# EAGLE design IR Sensor (EAGLE 9.6.2)
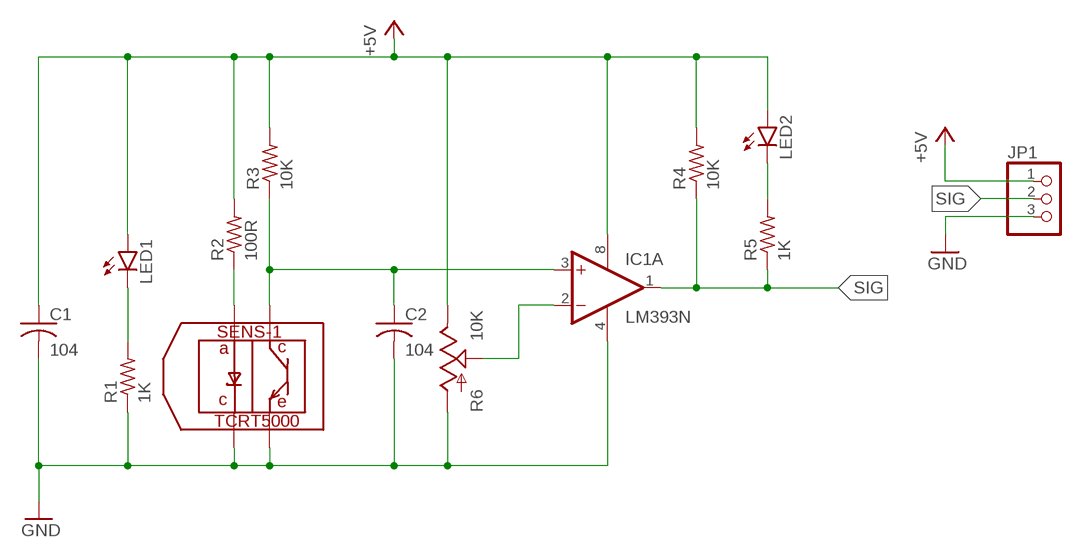
[diagram p0: schematic, sheet 1]

## Parts
C1  104  C-US050-045X075  [C050-045X075]
C2  104  C-US050-045X075  [C050-045X075]
IC1  LM393N  [DIL08]
JP1  PINHD-1X3  [1X03]
LED1  LED3MM  [LED3MM]
LED2  LED3MM  [LED3MM]
R1  1K  R-US_0207/7  [0207/7]
R2  100R  R-US_0207/7  [0207/7]
R3  10K  R-US_0207/7  [0207/7]
R4  10K  R-US_0207/7  [0207/7]
R5  1K  R-US_0207/7  [0207/7]
R6  10K  TRIM_US-CA6V  [CA6V]
SENS-1  TCRT5000  [5000]

## Nets
+5V: C1.1 IC1.8(P:V+) JP1.1 LED1.A LED2.A R2.2 R3.2 R4.2 R6.E
GND: C1.2 C2.2 IC1.4(P:V-) JP1.3 R1.1 R6.A SENS-1.P$2 SENS-1.P$4
N$1: LED1.K(C) R1.2
N$2: IC1.2(A:-IN) R6.S
N$3: R2.1 SENS-1.P$3
N$5: C2.1 IC1.3(A:+IN) R3.1 SENS-1.P$1
N$6: LED2.K(C) R5.2
SIG: IC1.1(A:OUT) JP1.2 R4.1 R5.1
Unconnected: IC1.5(B:+IN) IC1.6(B:-IN) IC1.7(B:OUT)

## Library data of the parts
C1 C2 = resistor:C-US: CAPACITOR, American symbol
IC1 = linear:LM393: COMPARATOR
JP1 = pinhead:PINHD-1X3: PIN HEADER
LED1 LED2 = led:LED: LED OSRAM: - CHIPLED LG R971, LG N971, LY N971, LG Q971, LY Q971, LO R971, LY R971 LH N974, LH R974 LS Q976, LO Q976, LY Q976 LO Q996 - Hyper CHIPLED LW Q18S LB Q993, LB Q99A, LB R99A - SideLED LS A670, LO A670, LY A670, LG A670, LP A670 LB A673, LV A673, LT A673, LW A673 LH A674 LY A675 LS A676, LA A676, LO A676, LY A676, LW A676 LS A679, LY A679, LG A679 - Hyper Micro SIDELED® LS Y876, LA Y876, LO Y876, LY Y876 LT Y87S - SmartLED LW L88C, LW L88S LB L89C, LB L89S, LG L890 LS L89K, LO L89K, LY L89K LS L896, LA L896, LO L896, LY L896 - TOPLED LS T670, LO T670, LY T670, LG T670, LP T670 LSG T670, LSP T670, LSY T670, LOP T670, LYG T670 LG T671, LOG T671, LSG T671 LB T673, LV T673, LT T673, LW T673 LH T674 LS T676, LA T676, LO T676, LY T676, LB T676, LH T676, LSB T676, LW T676 LB T67C, LV T67C, LT T67C, LS T67K, LO T67K, LY T67K, LW E67C LS E67B, LA E67B, LO E67B, LY E67B, LB E67C, LV E67C, LT E67C LW T67C LS T679, LY T679, LG T679 LS T770, LO T770, LY T770, LG T770, LP T770 LB T773, LV T773, LT T773, LW T773 LH T774 LS E675, LA E675, LY E675, LS T675 LS T776, LA T776, LO T776, LY T776, LB T776 LHGB T686 LT T68C, LB T68C - Hyper Mini TOPLED® LB M676 - Mini TOPLED Santana® LG M470 LS M47K, LO M47K, LY M47K Source: http://www.osram.convergy.de LUXEON: - LUMILED® LXK2-PW12-R00, LXK2-PW12-S00, LXK2-PW14-U00, LXK2-PW14-V00 LXK2-PM12-R00, LXK2-PM12-S00, LXK2-PM14-U00 LXK2-PE12-Q00, LXK2-PE12-R00, LXK2-PE12-S00, LXK2-PE14-T00, LXK2-PE14-U00 LXK2-PB12-K00, LXK2-PB12-L00, LXK2-PB12-M00, LXK2-PB14-N00, LXK2-PB14-P00, LXK2-PB14-Q00 LXK2-PR12-L00, LXK2-PR12-M00, LXK2-PR14-Q00, LXK2-PR14-R00 LXK2-PD12-Q00, LXK2-PD12-R00, LXK2-PD12-S00 LXK2-PH12-R00, LXK2-PH12-S00 LXK2-PL12-P00, LXK2-PL12-Q00, LXK2-PL12-R00 Source: www.luxeon.com KINGBRIGHT: KA-3528ASYC Source: www.kingbright.com
R1-R5 = resistor:R-US_: RESISTOR, American symbol
R6 = pot:TRIM_US-: POTENTIOMETER
SENS-1 = qfm-trx1-24g:TCRT5000: Reflective Optical Sensor with Transistor Output. Vishay Semiconductors

## Board
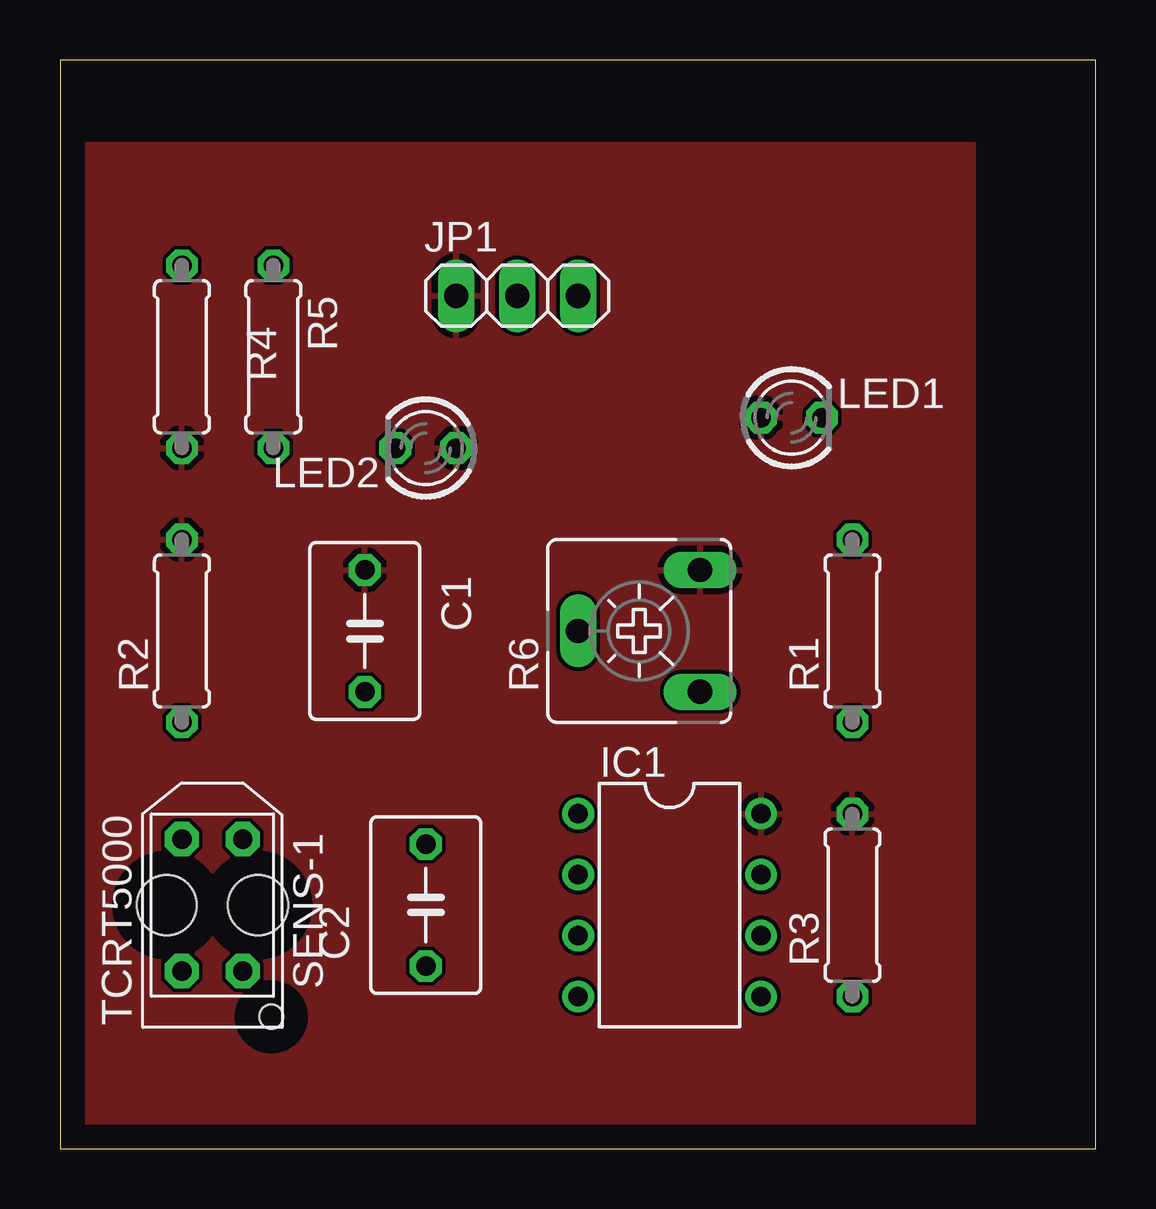
[diagram p1: board, top side]
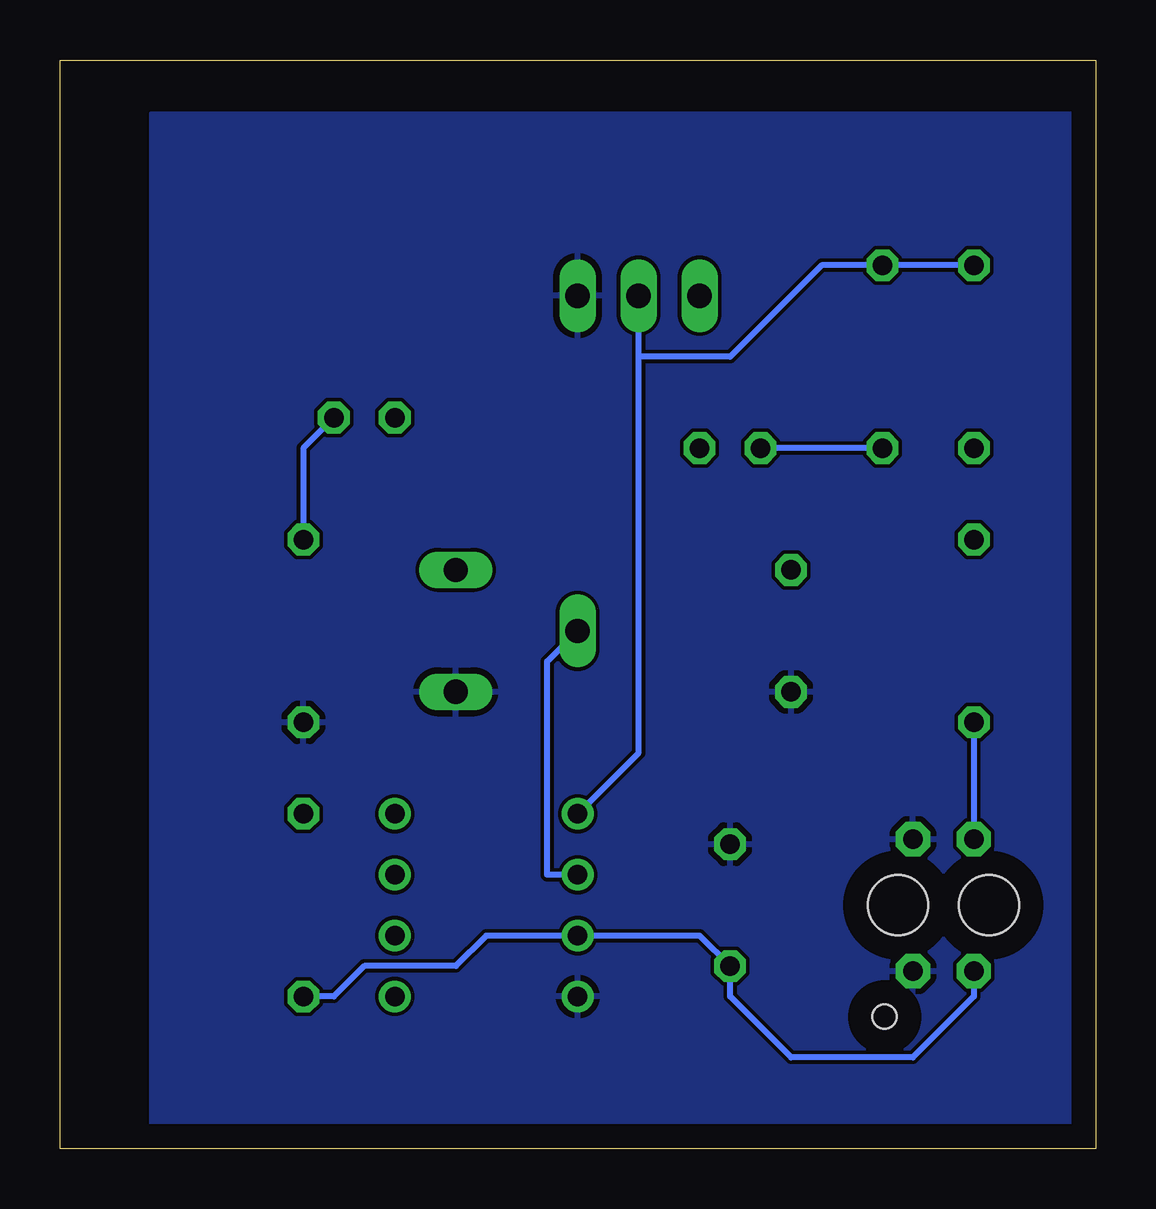
[diagram p2: board, bottom side, seen from below]

Size 43.16 x 45.39 mm. Coordinates in mm from the lower left corner, seen from the top.
Outline: 0,0 43.16,0 43.16,45.39 0,45.39 0,0
Copper layers (1*16): Top 0.035mm / dielectric 1.5mm / Bottom 0.035mm
Design rules "default": minimum track width 6mil, minimum drill 0.35mm, track to track 6mil, track to pad 6mil, pad to pad 6mil, via to via 6mil, smd to smd 6mil, copper to edge 40mil, drill to drill 6mil, minimum pad ring 10mil, minimum via ring 8mil, stop-mask expansion 4mil, vias tented up to drill 0mil, thermal gap 10mil

### Footprints (pad centres in the part's own frame; a part is rotated, then mirrored left to right if it is on the bottom)
C050-045X075 = drill 0.813 octagon: 1 -2.54,0; 2 2.54,0
DIL08 = drill 0.813 pad 1.27: 1 -3.81,-3.81; 2 -1.27,-3.81; 3 1.27,-3.81; 4 3.81,-3.81; 5 3.81,3.81; 6 1.27,3.81; 7 -1.27,3.81; 8 -3.81,3.81
1X03 = drill 1.016 long: 1 -2.54,0; 2 0,0; 3 2.54,0
LED3MM = drill 0.813 octagon: A -1.27,0; K 1.27,0
0207/7 = drill 0.813 octagon: 1 -3.81,0; 2 3.81,0
CA6V = drill 1.016 long: A -2.54,-2.54; E 2.54,-2.54; S 0,2.54
5000 = drill 0.8 pad 1.422 octagon: P$1 -2.75,1.27; P$2 -2.75,-1.27; P$3 2.75,1.27; P$4 2.75,-1.27 | hole 2.5: 0,1.9; 0,-1.9 | hole 1: -4.65,-2.45

### Placement (x,y rotation side)
C1  12.7,21.59 270 top
C2  15.24,10.16 90 top
IC1  25.4,10.16 270 top
JP1  19.05,35.56 0 top
LED1  30.48,30.48 0 top
LED2  15.24,29.21 180 top
R1  33.02,21.59 90 top
R2  5.08,21.59 90 top
R3  33.02,10.16 90 top
R4  5.08,33.02 270 top
R5  8.89,33.02 270 top
R6  24.13,21.59 90 top
SENS-1  6.35,10.16 90 top

### Tracks (layer width: path | path; a pad name or v marks a point on that pad's centre or on a via)
+5V
  pour Top: -2.54,-1.27 -2.54,41.91 38.1,41.91 38.1,-1.27
GND
  pour Bottom: -3.81,-2.54 -3.81,43.18 39.37,43.18 39.37,-2.54
N$1
  Bottom 0.254: LED1.K 33.02,29.21 R1.2
N$2
  Bottom 0.254: IC1.2 22.86,11.43 22.86,20.32 R6.S
N$3
  Bottom 0.254: R2.1 SENS-1.P$3
N$5
  Bottom 0.254: SENS-1.P$1 5.08,6.35 7.62,3.81 12.7,3.81 15.24,6.35 C2.1 16.51,8.89 IC1.3 25.4,8.89 26.67,7.62 30.48,7.62 31.75,6.35 R3.1
N$6
  Bottom 0.254: R5.2 LED2.K
SIG
  Bottom 0.254: IC1.1 19.05,16.51 19.05,33.02 | 19.05,33.02 JP1.2 | R4.1 R5.1 11.43,36.83 15.24,33.02 19.05,33.02